# EAGLE design processorboard (EAGLE 7.4.0)
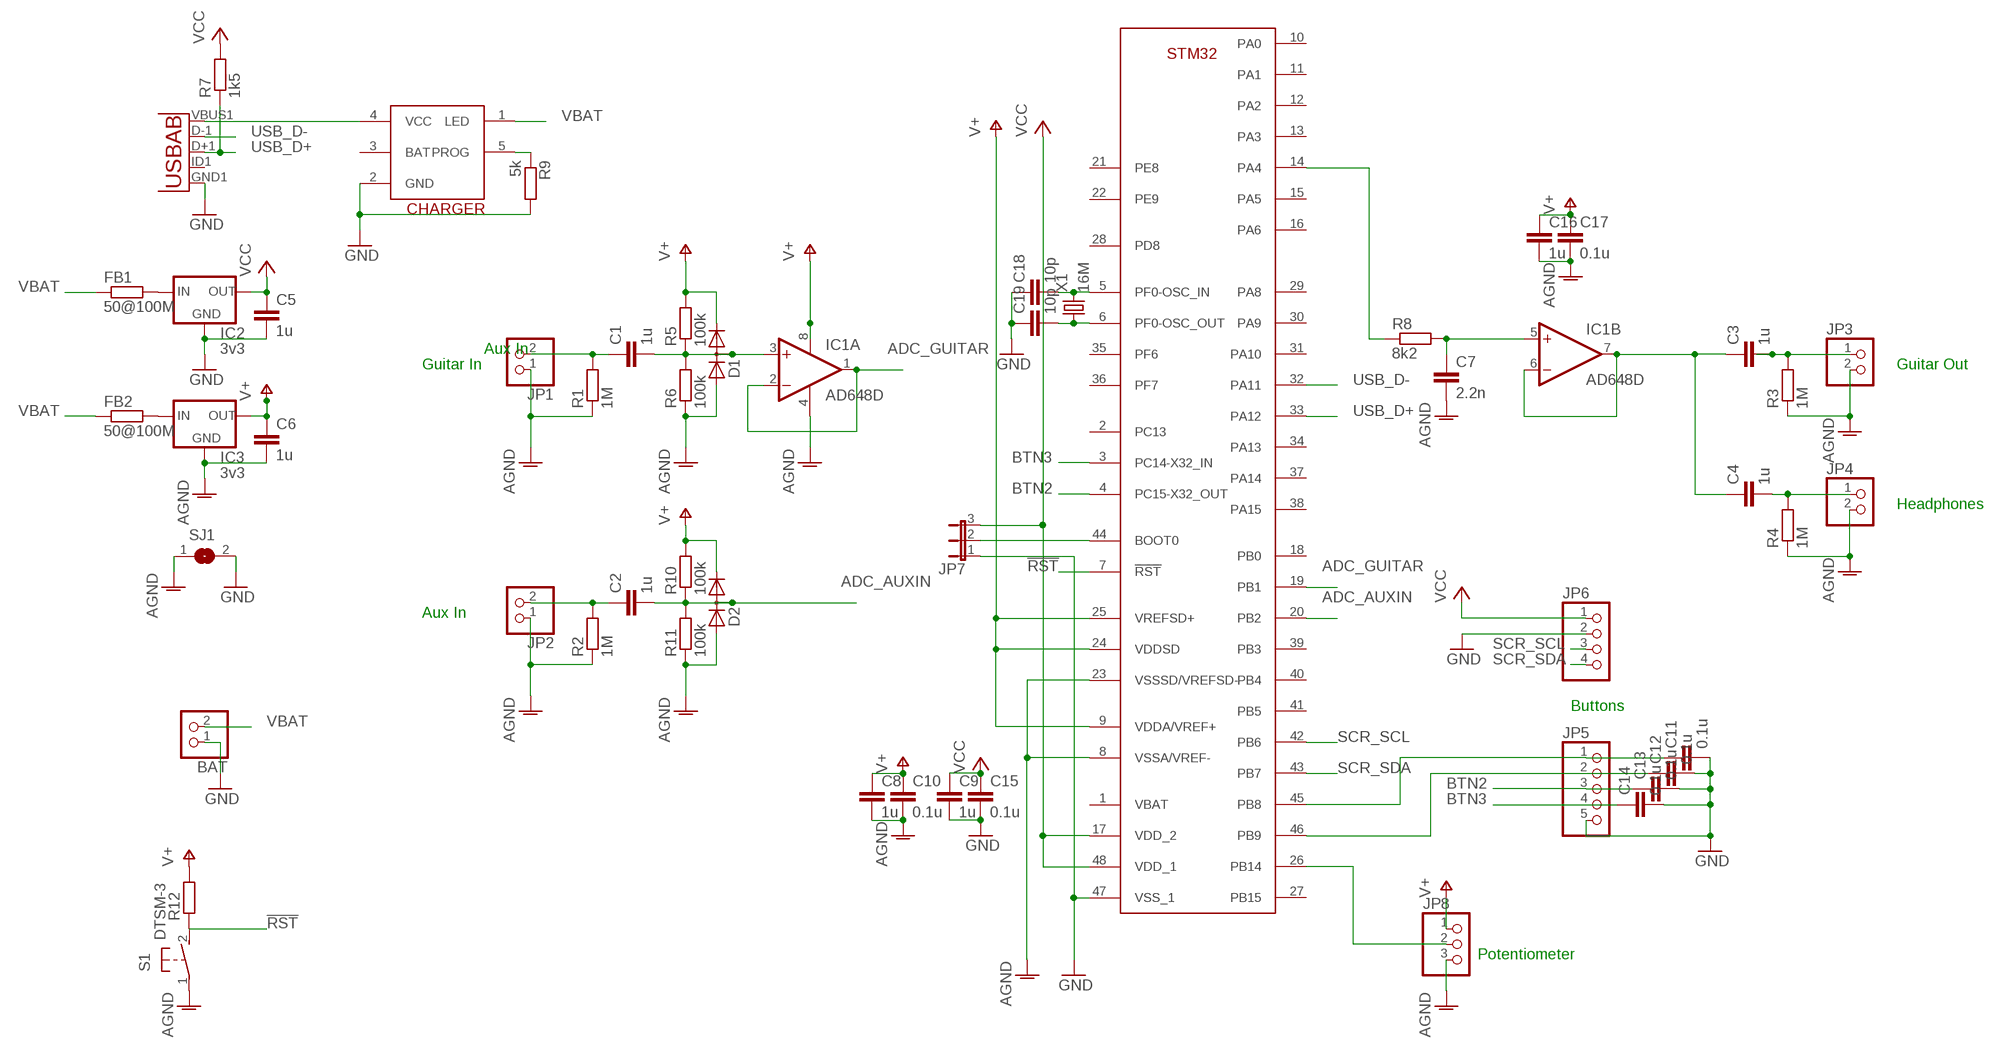
[diagram p0: schematic, sheet 1]

## Parts
BAT  PINHD-1X2  [1X02]
C1  1u  C-EUC0805  [C0805]
C2  1u  C-EUC0805  [C0805]
C3  1u  C-EUC0805  [C0805]
C4  1u  C-EUC0805  [C0805]
C5  1u  C-EUC0805  [C0805]
C6  1u  C-EUC0805  [C0805]
C7  2.2n  C-EUC0805  [C0805]
C8  1u  C-EUC0805  [C0805]
C9  1u  C-EUC0805  [C0805]
C10  0.1u  C-EUC0805  [C0805]
C11  0.1u  C-EUC0805  [C0805]
C12  0.1u  C-EUC0805  [C0805]
C13  0.1u  C-EUC0805  [C0805]
C14  0.1u  C-EUC0805  [C0805]
C15  0.1u  C-EUC0805  [C0805]
C16  1u  C-EUC0805  [C0805]
C17  0.1u  C-EUC0805  [C0805]
C18  10p  C-EUC0805  [C0805]
C19  10p  C-EUC0805  [C0805]
D1  DIODE_2CACA-SOT23  [SOT23]
D2  DIODE_2CACA-SOT23  [SOT23]
FB1  50@100M  R-EU_R0805  [R0805]
FB2  50@100M  R-EU_R0805  [R0805]
IC1  AD648D  [SO08]
IC2  3v3  XC63FPM  [SOT23]
IC3  3v3  XC63FPM  [SOT23]
JP1  PINHD-1X2  [1X02]
JP2  PINHD-1X2  [1X02]
JP3  PINHD-1X2  [1X02]
JP4  PINHD-1X2  [1X02]
JP5  PINHD-1X5  [1X05]
JP6  PINHD-1X4  [1X04]
JP7  JP2E  [JP2]
JP8  PINHD-1X3  [1X03]
R1  1M  R-EU_R0805  [R0805]
R2  1M  R-EU_R0805  [R0805]
R3  1M  R-EU_R0805  [R0805]
R4  1M  R-EU_R0805  [R0805]
R5  100k  R-EU_R0805  [R0805]
R6  100k  R-EU_R0805  [R0805]
R7  1k5  R-EU_R0805  [R0805]
R8  8k2  R-EU_R0805  [R0805]
R9  5k  R-EU_R0805  [R0805]
R10  100k  R-EU_R0805  [R0805]
R11  100k  R-EU_R0805  [R0805]
R12  R-EU_R0805  [R0805]
S1  DTSM-3  [DTSM-3]
SJ1  SJ  [SJ]
U1  USB""  [USB-MICRO-SMD]
U$1  STM32F373CBT6  [LQFP48]
U$2  LI_CHARGER  [SOT23-5L]
X1  16M  CRYSTALHC49UP  [HC49UP]

## Nets
!RST: R12.1 S1.2 U$1.7(!RST)
ADC_AUXIN: C2.2 D2.3(AC) R10.1 R11.2 U$1.20(PB2)
ADC_GUITAR: IC1.1(A:OUT) IC1.2(A:-IN) U$1.19(PB1)
AGND: C6.2 C7.2 C8.2 C10.2 C16.2 C17.2 D1.1(A) D2.1(A) IC1.4(P:V-) IC3.1(GND) JP1.1 JP2.1 JP3.2 JP4.2 JP8.3 R1.1 R2.1 R3.1 R4.1 R6.1 R11.1 S1.1 SJ1.1 U$1.8(VSSA/VREF-) U$1.23(VSSSD/VREFSD-)
BTN0: C11.1 JP5.1 U$1.45(PB8)
BTN1: C12.1 JP5.2 U$1.46(PB9)
BTN2: C13.1 JP5.3 U$1.4(PC15-X32_OUT)
BTN3: C14.1 JP5.4 U$1.3(PC14-X32_IN)
DAC_GUITAR: R8.1 U$1.14(PA4)
DAC_GUITAR_FILT: C7.1 IC1.5(B:+IN) R8.2
GND: BAT.1 C5.2 C9.2 C11.2 C12.2 C13.2 C14.2 C15.2 C18.1 C19.1 IC2.1(GND) JP5.5 JP6.2 JP7.1 R9.2 SJ1.2 U1.GND1(GND) U$1.47(VSS_1) U$2.2(GND)
N$1: C3.2 JP3.1 R3.2
N$2: C4.2 JP4.1 R4.2
N$3: C2.1 JP2.2 R2.2
N$4: JP7.2 U$1.44(BOOT0)
N$5: C1.1 JP1.2 R1.2
N$6: C1.2 D1.3(AC) IC1.3(A:+IN) R5.1 R6.2
N$7: C19.2 U$1.6(PF0-OSC_OUT) X1.1
N$8: JP8.2 U$1.26(PB14)
N$9: FB1.2 IC2.3(IN)
N$10: C3.1 C4.1 IC1.6(B:-IN) IC1.7(B:OUT)
N$11: R9.1 U$2.5(PROG)
N$13: FB2.2 IC3.3(IN)
N$18: C18.2 U$1.5(PF0-OSC_IN) X1.2
SCR_SCL: JP6.3 U$1.42(PB6)
SCR_SDA: JP6.4 U$1.43(PB7)
USB_D+: R7.1 U1.D+1(D+) U$1.33(PA12)
USB_D-: U1.D-1(D-) U$1.32(PA11)
V+: C6.1 C8.1 C10.1 C16.1 C17.1 D1.2(C) D2.2(C) IC1.8(P:V+) IC3.2(OUT) JP8.1 R5.2 R10.2 R12.2 U$1.9(VDDA/VREF+) U$1.24(VDDSD) U$1.25(VREFSD+)
VBAT: BAT.2 FB1.1 FB2.1 U$2.1(LED)
VCC: C5.1 C9.1 C15.1 IC2.2(OUT) JP6.1 JP7.3 R7.2 U$1.17(VDD_2) U$1.48(VDD_1)
VUSB: U1.VBUS1(VBUS) U$2.4(VCC)
Unconnected: U1.ID1(USBID) U$1.1(VBAT) U$1.2(PC13) U$1.10(PA0) U$1.11(PA1) U$1.12(PA2) U$1.13(PA3) U$1.15(PA5) U$1.16(PA6) U$1.18(PB0) U$1.21(PE8) U$1.22(PE9) U$1.27(PB15) U$1.28(PD8) U$1.29(PA8) U$1.30(PA9) U$1.31(PA10) U$1.34(PA13) U$1.35(PF6) U$1.36(PF7) U$1.37(PA14) U$1.38(PA15) U$1.39(PB3) U$1.40(PB4) U$1.41(PB5) U$2.3(BAT)

## Notes on the sheet
- Aux In
- Guitar In | Guitar Out
- Headphones
- Aux In
- Buttons
- Potentiometer

## Library data of the parts
BAT JP1-JP4 = pinhead:PINHD-1X2: PIN HEADER
C1-C19 = rcl:C-EU: CAPACITOR, European symbol
D1 D2 = diode:DIODE_2CACA-: 2 Diodes - Cathode-Anode|Cathode-Anode
FB1 FB2 R1-R12 = rcl:R-EU_: RESISTOR, European symbol
IC1 = linear:AD648: OP AMP
IC2 IC3 = v-reg:XC63FP: Positiv Voltage Regulators www.torex.co.jp/english/product/pro02/pdf/0201_xc62fp.pdf
JP5 = pinhead:PINHD-1X5: PIN HEADER
JP6 = pinhead:PINHD-1X4: PIN HEADER
JP7 = jumper:JP2E: JUMPER
JP8 = pinhead:PINHD-1X3: PIN HEADER
S1 = switch-tact:DTSM-3
SJ1 = jumper:SJ: SMD solder JUMPER
U1 = MicroUSB:USB: This is a USB AB connector that is compatible with USB OTG. i.e. this connector can serve as a host or device
U$1 = pedal_parts:STM32F373CBT6
U$2 = pedal_parts:LI_CHARGER
X1 = crystal:CRYSTAL: CRYSTAL; OC_FARNELL: unknown; OC_NEWARK: unknown

## Board
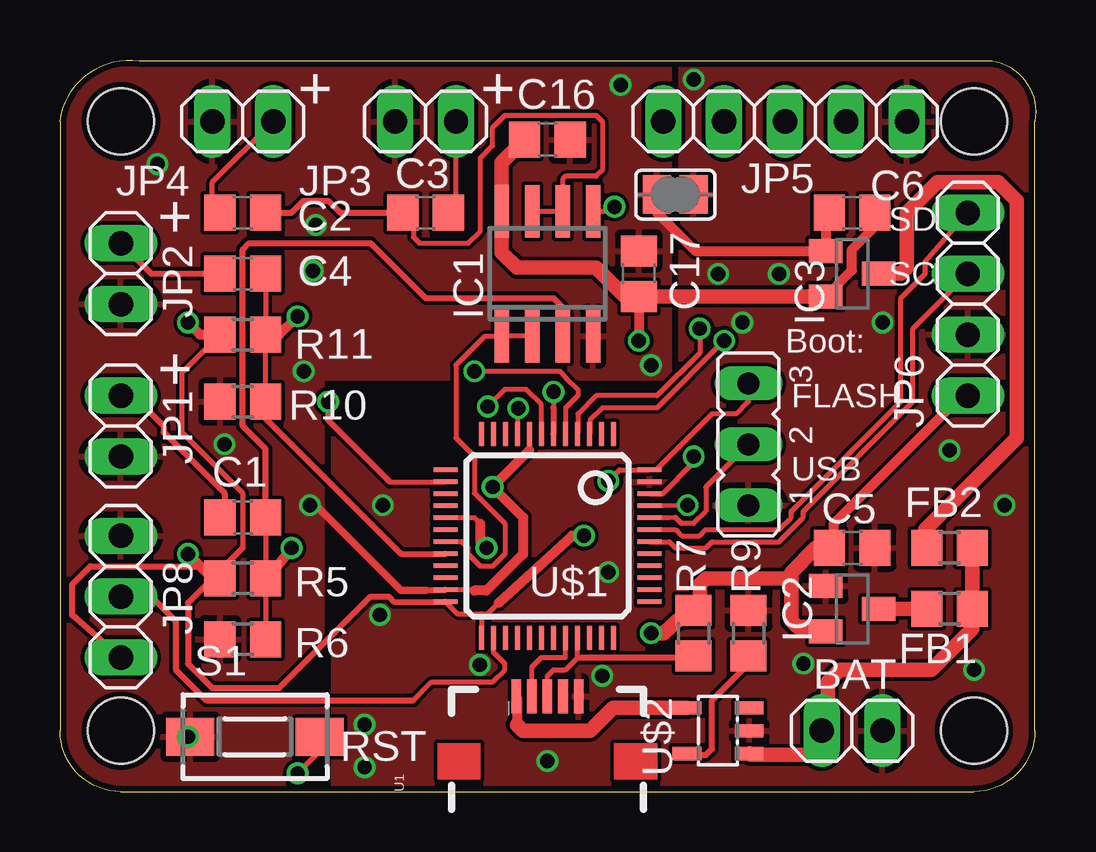
[diagram p1: board, top side]
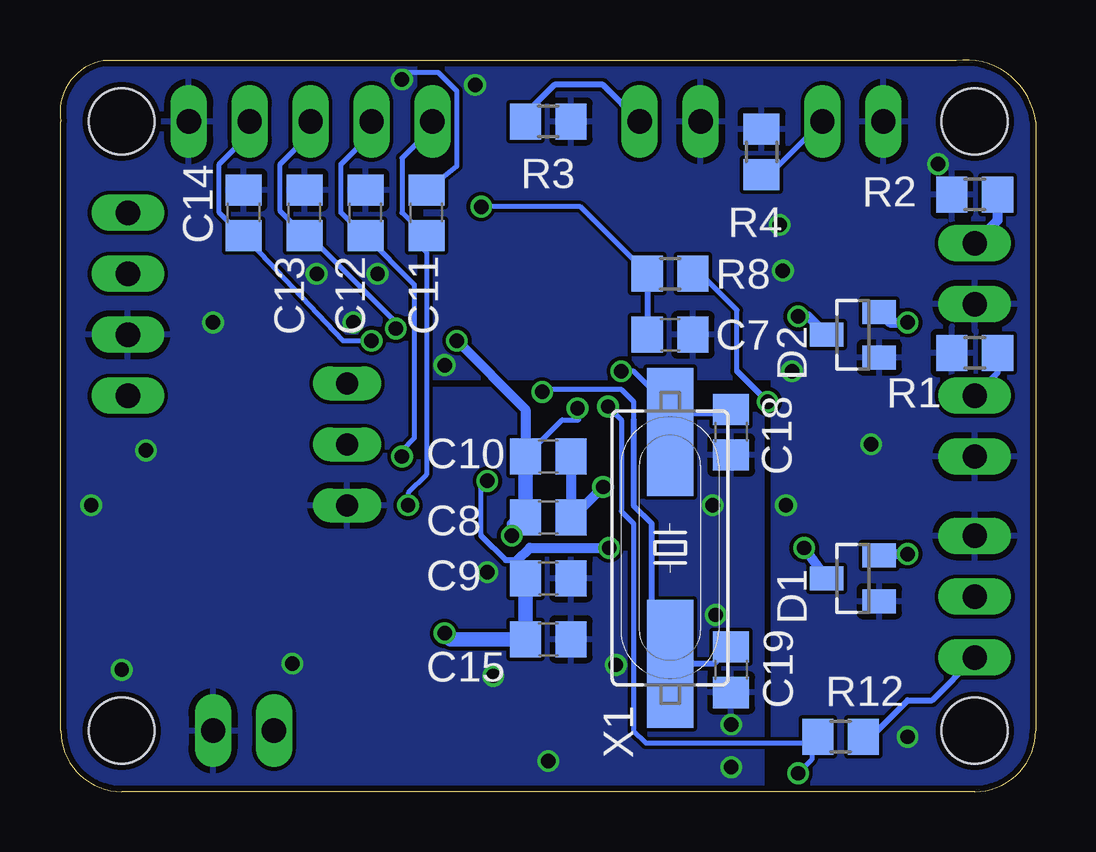
[diagram p2: board, bottom side, seen from below]

Size 40.67 x 30.5 mm. Coordinates in mm from the lower left corner, seen from the top.
Outline: 0,27.94 0,2.54 arc90 2.54,0 38.1,0 arc90 40.64,2.54 40.64,27.94 arc90 38.86,30.48 3.3,30.48 arc90 0,27.94
Copper layers (1*16): Top 0.035mm / dielectric 1.5mm / Bottom 0.035mm
Design rules "ITead_rule": minimum track width 6mil, minimum drill 12mil, track to track 6mil, track to pad 6mil, pad to pad 6mil, via to via 6mil, smd to smd 0mil, copper to edge 10mil, drill to drill 10mil, minimum pad ring 10mil, minimum via ring 6mil, stop-mask expansion 2mil, vias tented up to drill 100mil, thermal gap 10mil
Holes 2.75 mm at 2.54,27.94 2.54,2.54 38.1,2.54 38.1,27.94

### Footprints (pad centres in the part's own frame; a part is rotated, then mirrored left to right if it is on the bottom)
1X02 = drill 1.016 long: 1 -1.27,0; 2 1.27,0
C0805 = smd 1.3 x 1.5: 1 -0.95,0; 2 0.95,0
SOT23 = smd 1 x 1.4: 1 -0.95,-1.1; 2 0.95,-1.1; 3 0,1.1
R0805 = smd 1.3 x 1.5: 1 -0.95,0; 2 0.95,0
SO08 = smd 0.6 x 2.2: 1 -1.905,-2.6; 2 -0.635,-2.6; 3 0.635,-2.6; 4 1.905,-2.6; 5 1.905,2.6; 6 0.635,2.6; 7 -0.635,2.6; 8 -1.905,2.6
1X05 = drill 1.016 long: 1 -5.08,0; 2 -2.54,0; 3 0,0; 4 2.54,0; 5 5.08,0
1X04 = drill 1.016 long: 1 -3.81,0; 2 -1.27,0; 3 1.27,0; 4 3.81,0
JP2 = drill 0.914 long: 1 -2.54,0; 2 0,0; 3 2.54,0
1X03 = drill 1.016 long: 1 -2.54,0; 2 0,0; 3 2.54,0
DTSM-3 = smd 2 x 1.6: 1 -2.7,0; 2 2.7,0
SJ = smd 1.168 x 1.6: 1 -0.762,0; 2 0.762,0
USB-MICRO-SMD = smd 1.4 x 0.4: D+1 2.7,0; D-1 2.7,0.65; GND1 2.7,-1.3; ID1 2.7,-0.65; VBUS1 2.7,1.3
LQFP48 = smd 0.2 x 1: 1 -2.75,-4.25; 2 -2.25,-4.25; 3 -1.75,-4.25; 4 -1.25,-4.25; 5 -0.75,-4.25; 6 -0.25,-4.25; 7 0.25,-4.25; 8 0.75,-4.25; 9 1.25,-4.25; 10 1.75,-4.25; 11 2.25,-4.25; 12 2.75,-4.25; 25 2.75,4.25; 26 2.25,4.25; 27 1.75,4.25; 28 1.25,4.25; 29 0.75,4.25; 30 0.25,4.25; 31 -0.25,4.25; 32 -0.75,4.25; 33 -1.25,4.25; 34 -1.75,4.25; 35 -2.25,4.25; 36 -2.75,4.25 | smd 1 x 0.2: 13 4.25,-2.75; 14 4.25,-2.25; 15 4.25,-1.75; 16 4.25,-1.25; 17 4.25,-0.75; 18 4.25,-0.25; 19 4.25,0.25; 20 4.25,0.75; 21 4.25,1.25; 22 4.25,1.75; 23 4.25,2.25; 24 4.25,2.75; 37 -4.25,2.75; 38 -4.25,2.25; 39 -4.25,1.75; 40 -4.25,1.25; 41 -4.25,0.75; 42 -4.25,0.25; 43 -4.25,-0.25; 44 -4.25,-0.75; 45 -4.25,-1.25; 46 -4.25,-1.75; 47 -4.25,-2.25; 48 -4.25,-2.75
SOT23-5L = smd 0.55 x 1.2: 1 -0.95,-1.3; 2 0,-1.3; 3 0.95,-1.3; 4 0.95,1.3; 5 -0.95,1.3
HC49UP = smd 5.334 x 1.93: 1 -4.826,0; 2 4.826,0

### Placement (x,y rotation side)
BAT  33.02,2.54 180 top
C1  7.62,11.43 0 top
C2  7.62,21.59 0 top
C3  15.24,24.13 0 top
C4  7.62,24.13 180 top
C5  33.02,10.16 0 top
C6  33.02,24.13 180 top
C7  15.24,19.05 0 bottom
C8  20.32,11.43 0 bottom
C9  20.32,8.89 0 bottom
C10  20.32,13.97 0 bottom
C11  25.4,24.13 90 bottom
C12  27.94,24.13 90 bottom
C13  30.48,24.13 90 bottom
C14  33.02,24.13 90 bottom
C15  20.32,6.35 0 bottom
C16  20.32,27.18 0 top
C17  24.13,21.59 90 top
C18  12.7,14.99 90 bottom
C19  12.7,5.08 90 bottom
D1  7.62,8.89 90 bottom
D2  7.62,19.05 90 bottom
FB1  37.08,7.62 180 top
FB2  37.08,10.16 180 top
IC1  20.32,21.59 0 top
IC2  33.02,7.62 270 top
IC3  33.02,21.59 270 top
JP1  2.54,15.24 90 top
JP2  2.54,21.59 90 top
JP3  15.24,27.94 180 top
JP4  7.62,27.94 180 top
JP5  30.23,27.94 0 top
JP6  37.85,20.32 90 top
JP7  28.7,14.48 90 top
JP8  2.54,8.13 90 top
R1  2.54,18.29 0 bottom
R2  2.54,24.89 0 bottom
R3  20.32,27.94 180 bottom
R4  11.43,26.67 270 bottom
R5  7.62,8.89 180 top
R6  7.62,6.35 0 top
R7  26.42,6.6 90 top
R8  15.24,21.59 180 bottom
R9  28.7,6.6 90 top
R10  7.62,19.05 180 top
R11  7.62,16.26 0 top
R12  8.13,2.29 0 bottom
S1  8.13,2.29 0 top
SJ1  25.65,24.89 0 top
U1  20.32,1.27 90 top
U$1  20.32,10.67 180 top
U$2  27.43,2.54 90 top
X1  15.24,10.16 90 bottom

### Tracks (layer width: path | path; a pad name or v marks a point on that pad's centre or on a via)
!RST  (via drill 0.6)
  Top 0.203: U$1.7 20.07,16.13 19.43,16.76 18.54,16.76 v17.83,16.05 | v9.91,0.76 10.83,1.68 S1.2
  Bottom 0.203: v17.83,16.05 17.27,15.49 17.27,11.68 16.76,11.18 16.76,2.54 16.26,2.03 9.33,2.03 | 9.33,2.03 R12.1 | 9.33,2.03 9.33,1.34 v9.91,0.76
ADC_AUXIN  (via drill 0.6)
  Top 0.203: C2.2 R10.1 R11.2
  Top 0.254: R11.2 8.57,15.56 14.21,9.92 U$1.20
  Top 0.406: v9.91,19.81 9.14,19.05 R10.1
  Bottom 0.406: D2.3 9.48,19.81 v9.91,19.81
ADC_GUITAR
  Top 0.203: IC1.2 IC1.1 17.72,18.99 16.51,17.78 16.51,14.73 17.27,13.97 17.27,12.45 18.54,11.18 18.54,9.91 18.03,9.4 17.53,9.4 17.02,9.91 17.02,10.16 16.76,10.42 U$1.19
AGND  (via drill 0.6)
  Top 0.203: 17.27,8.38 17.24,8.42 U$1.23 | U$1.8 19.57,14.24 | SJ1.1 24.89,24.13
  Top 0.254: 15.24,8.38 15.28,8.42 U$1.23
  Top 0.305: 15.24,8.38 14.22,8.38 10.67,11.94 v10.41,11.94
  Top 0.406: 17.27,8.38 17.78,8.38 19.3,9.91 19.3,11.43 v18.03,12.7 19.57,14.24 | 24.89,24.13 26.48,22.54 IC3.1 31.92,23.98 C6.2
  Bottom 0.406: C10.2 C8.2 19.3,11.43 v18.03,12.7
  other vias: 10.16,17.53 10.54,21.72 5.33,2.29 6.86,14.48 24.64,17.78 23.37,29.46 4.06,26.16 10.67,23.62
  pour Bottom: 25.4,30.48 0,30.48 0,0 10.92,0 10.92,17.27 25.4,17.27
  pour Top: 10.92,0 10.92,17.27 25.4,17.27 25.4,30.48 0,30.48 0,0
BTN0  (via drill 0.6)
  Top 0.203: v26.16,11.94 25.13,11.92 U$1.45
  Bottom 0.203: 25.47,23.18 26.42,24.13 26.42,26.42 25.15,27.69 JP5.1 | 25.47,23.18 C11.1 | 25.47,23.18 25.91,22.99 25.4,22.48 25.4,13.21 26.16,12.45 v26.16,11.94
BTN1  (via drill 0.6)
  Top 0.203: U$1.46 25.12,12.42 26.42,13.72 v26.42,13.97
  Bottom 0.203: v26.42,13.97 26.42,14.22 25.91,14.73 25.91,21.15 C12.1 28.01,23.18 28.96,24.13 28.96,26.16 27.69,27.43 JP5.2
BTN2  (via drill 0.6)
  Top 0.203: v26.67,19.3 26.67,18.29 24.89,16.51 22.35,16.51 21.59,15.75 21.59,14.94 U$1.4
  Bottom 0.203: v26.67,19.3 26.67,19.56 30.29,23.18 C13.1 31.5,24.2 31.5,26.16 30.23,27.43 JP5.3
BTN3  (via drill 0.6)
  Top 0.203: v27.69,18.8 24.89,16 22.61,16 22.1,15.49 22.1,14.95 U$1.3
  Bottom 0.203: v27.69,18.8 28.89,18.8 C14.1 33.09,23.18 34.04,24.13 34.04,26.16 32.77,27.43 JP5.4
DAC_GUITAR  (via drill 0.6)
  Top 0.203: 13.75,12.92 U$1.14
  Top 0.254: v11.18,16.26 11.18,15.49 13.75,12.92
  Bottom 0.203: 12.45,17.53 12.45,20.07 13.97,21.59 R8.1
  Bottom 0.254: 12.45,17.53 v11.18,16.26
DAC_GUITAR_FILT  (via drill 0.6)
  Top 0.203: v23.11,24.38 22.92,24.19 IC1.5
  Bottom 0.203: R8.2 18.98,24.38 v23.11,24.38
  Bottom 0.254: R8.2 C7.1
GND  (via drill 0.6)
  Bottom 0.203: C11.2 24.13,26.1 24.13,29.21 24.89,29.97 26.16,29.97
  other vias: 12.7,2.79 37.08,14.22 39.37,11.94 30.99,5.33 34.29,19.56 22.86,9.14 28.45,19.56 27.43,21.59 29.97,21.59 38.1,5.08 13.46,11.94 12.7,1.02 20.32,1.27 26.42,29.69 22.61,4.83 17.5,5.28 13.34,7.37
  pour Top: 11.43,0 11.43,16.76 25.91,16.76 25.91,30.48 40.64,30.48 40.64,0
  pour Bottom: 11.43,0 40.64,0 40.64,30.48 25.91,30.48 25.91,16.76 11.43,16.76
N$1
  Top 0.203: C3.2 16.51,24.45 JP3.1
  Bottom 0.254: JP3.1 18.03,29.46 20.07,29.46 21.27,28.26 R3.2
N$2
  Top 0.203: C4.2 6.35,24.45 6.35,25.4 JP4.1
  Bottom 0.203: JP4.1 11.11,25.72 R4.2
N$3
  Top 0.254: JP2.2 3.81,21.59 C2.1
  Bottom 0.406: R2.2 1.59,23.81 JP2.2
N$4
  Top 0.203: JP7.2 26.92,12.7 26.92,11.68 26.42,11.18 25.91,11.18 25.65,11.43 25.39,11.42 U$1.44
N$5
  Top 0.254: JP1.2 3.05,16.51 4.32,15.24 4.32,14.99 6.86,12.45 6.86,11.62 C1.1
  Bottom 0.254: R1.2 1.59,17.46 JP1.2
N$6  (via drill 0.6)
  Top 0.203: C1.2 R5.1 R6.2
  Top 0.254: C1.2 8.57,14.29 7.62,15.24 7.62,22.61 7.87,22.86 12.95,22.86 15.24,20.57 20.57,20.57 21.08,20.07 21.08,18.86 IC1.3
  Top 0.406: v9.65,10.16 8.64,8.89 R5.1
  Bottom 0.406: D1.3 v9.65,10.16
N$7  (via drill 0.6)
  Top 0.203: v20.57,16.66 20.57,16.26 20.57,16.01
  Top 0.254: 20.57,16.01 U$1.6
  Bottom 0.203: v20.57,16.66 20.45,16.76 17.27,16.76 16.76,16.26 16.76,15.49
  Bottom 0.254: C19.2 13.4,5.33 X1.1 16,6.1 16,11.18 16.76,11.94 16.76,15.49
N$8
  Top 0.203: 14.73,3.81 15.49,4.57 18.03,4.57 18.54,5.08 18.54,5.33 18.07,5.81 U$1.26
  Top 0.254: JP8.2 3.81,8.13 4.83,7.11 4.83,5.08 6.1,3.81 14.73,3.81
N$9
  Top 0.61: FB1.2 IC2.3
N$10
  Top 0.203: 19.68,23.5 IC1.7 IC1.6 20.95,25.53 21.08,25.65 22.35,25.65 22.61,25.91 22.61,27.94 22.35,28.19 18.54,28.19 18.03,27.69 18.03,26.92 17.53,26.42 17.53,23.37 17.02,22.86 14.99,22.86 14.73,23.11 14.73,23.69 C3.1
  Top 0.254: C4.1 9.65,24.13 10.16,24.64 11.18,24.64 11.68,24.13 C3.1
N$11
  Top 0.254: U$2.5 26.2,1.52 26.92,1.52 27.18,1.78 27.18,3.81 28.7,5.33 R9.1
N$13
  Top 0.61: FB2.2 36.07,10.35 36.07,10.92 39.88,14.73 39.88,24.64 39.12,25.4 36.58,25.4 35.31,24.13 35.31,21.84 35.05,21.59 IC3.3
N$18  (via drill 0.6)
  Top 0.203: U$1.5 21.08,14.93 21.08,15.49 21.08,16 21.59,16.51 21.59,16.76 21.08,17.27 20.83,17.53 v17.27,17.53
  Bottom 0.203: C18.2 13.02,15.68 12.45,15.75 14.48,15.75 X1.2 15.49,15.24 15.49,16.26 16.76,17.53 v17.27,17.53
SCR_SCL
  Top 0.203: U$1.42 25.4,10.42 25.65,10.16 26.92,10.16 27.18,10.41 29.97,10.41 30.99,11.43 30.99,11.68 35.56,16.26 35.56,19.3 JP6.3
SCR_SDA
  Top 0.203: U$1.43 25.65,10.92 25.91,10.67 26.67,10.67 26.92,10.92 29.97,10.92 30.48,11.43 30.48,11.68 35.05,16.26 35.05,20.57 36.07,21.59 36.07,22.1 JP6.4
USB_D+
  Top 0.203: U1.D+1 20.32,4.83 20.57,5.08 21.08,5.08 21.57,5.57 U$1.33
  Top 0.254: R7.1 26.33,5.57 21.57,5.57
USB_D-
  Top 0.203: U1.D-1 19.67,5.19 20.07,5.59 21.07,5.59 U$1.32
V+  (via drill 0.6)
  Top 0.203: R10.2 5.08,17.46 5.08,14.99 7.62,12.45 7.62,10.16 6.67,9.21 R5.2 | 17.57,7.41 U$1.25 | U$1.24 16.58,7.41 17.57,7.41 | U$1.9 19.07,15.73 v19.1,15.98 | 17.57,7.41 17.82,7.41 18.29,7.87
  Top 0.254: 7.62,10.16 5.33,7.87 5.33,5.33 6.35,4.32 9.14,4.32 12.95,8.13 13.72,8.13 13.93,7.92 U$1.24 | JP8.1 0.51,7.37 0.51,8.64 1.27,9.4 6.16,9.4 R5.2
  Top 0.406: v21.84,10.67 21.34,10.67 18.29,7.87 | 24.13,20.83 C17.1 v24.13,18.8 | IC3.2 33.02,21.74 33.02,22.61 33.97,23.56 C6.1 | v5.33,19.56 5.84,19.05 R10.2 | v5.33,9.91 6.35,8.89 R5.2
  Top 0.61: C16.1 18.41,26.22 IC1.8 18.41,22.48 19.05,21.84 22.35,21.84 23.56,20.64 C17.1 IC3.2
  Bottom 0.203: C10.1 19.75,15.49 19.05,15.49 v19.1,15.98
  Bottom 0.254: R12.2 6.86,2.29 5.33,3.81 4.32,3.81 JP8.1
  Bottom 0.406: C8.1 21.84,11.18 v21.84,10.67 | v24.13,18.8 21.27,15.94 C10.1 | D2.2 6.08,19.56 v5.33,19.56 | D1.2 6.45,9.91 v5.33,9.91
  Bottom 0.61: C10.1 C8.1
VBAT
  Top 0.61: U$2.1 28.8,1.52 31.5,1.52 31.75,1.78 BAT.2 32,2.79 32,4.57 32.51,5.08 36.32,5.08 38.03,6.79 FB1.1 FB2.1
VCC  (via drill 0.6)
  Top 0.203: 17.53,11.18 17.28,11.42 U$1.17 | v22.86,12.95 23.32,13.42 U$1.48 24.85,13.42 27.18,15.75 28.19,15.75 28.7,16.26 JP7.3
  Top 0.406: v17.78,10.16 17.53,10.41 17.53,11.18 | C5.1 32.26,10.35 32.26,11.18 37.59,16.51 JP6.1
  Top 0.61: IC2.2 31.73,6.86 30.73,6.86 30.48,7.11 30.48,8.89 | 30.48,8.89 30.48,9.14 31.5,10.16 C5.1 | 30.48,8.89 26.92,8.89 26.67,8.64 26.67,7.81 R7.2 25.72,7.11 25.15,6.6 v24.64,6.6
  Bottom 0.203: 23.11,10.67 23.11,12.7 v22.86,12.95
  Bottom 0.254: 23.11,10.67 22.1,9.65 21.59,9.65
  Bottom 0.406: C9.1 21.59,8.96 21.59,9.65 21.08,10.16 v17.78,10.16
  Bottom 0.61: v24.64,6.6 24.38,6.35 C15.1 C9.1
VUSB
  Top 0.406: U1.VBUS1 19.05,3.94 19.05,2.79
  Top 0.61: 19.05,2.79 19.3,2.54 22.1,2.54 23.05,3.49 U$2.4

### Text on the board
tPlace: + | + | + | SD | SC | Boot: | + | FLASH | USB | RST